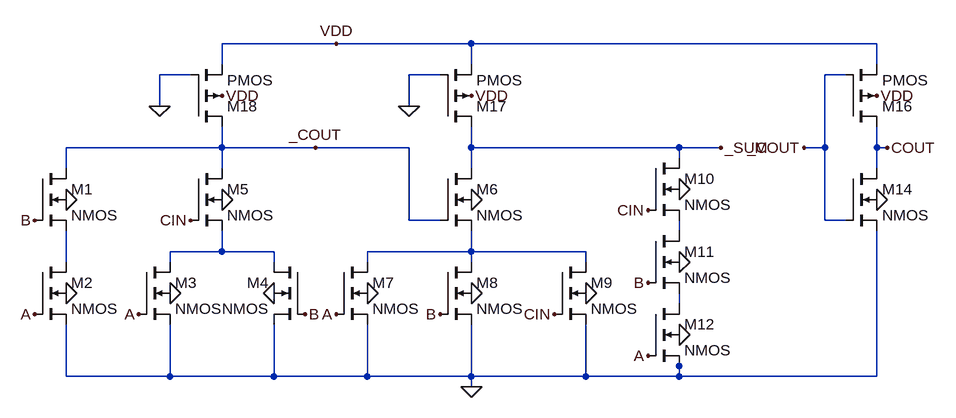
[diagram p0: schematic FA_psv1.asc]
FA_psv1.asc, the LTspice schematic file:
Version 4
SHEET 1 1232 680
WIRE 48 0 -128 0
WIRE 256 0 48 0
WIRE 880 0 256 0
WIRE -128 32 -128 0
WIRE 256 32 256 0
WIRE 880 32 880 0
WIRE -176 48 -224 48
WIRE 208 48 160 48
WIRE 832 48 800 48
WIRE -224 96 -224 48
WIRE 160 96 160 48
WIRE -128 160 -128 128
WIRE -128 160 -368 160
WIRE 16 160 -128 160
WIRE 160 160 16 160
WIRE 256 160 256 128
WIRE 576 160 256 160
WIRE 640 160 576 160
WIRE 800 160 800 48
WIRE 800 160 768 160
WIRE 880 160 880 128
WIRE 896 160 880 160
WIRE 576 176 576 160
WIRE -368 192 -368 160
WIRE -128 192 -128 160
WIRE 256 192 256 160
WIRE 880 192 880 160
WIRE 160 272 160 160
WIRE 208 272 160 272
WIRE 800 272 800 160
WIRE 832 272 800 272
WIRE 576 288 576 272
WIRE -128 320 -128 288
WIRE -128 320 -208 320
WIRE -48 320 -128 320
WIRE 256 320 256 288
WIRE 256 320 96 320
WIRE 432 320 256 320
WIRE -368 336 -368 288
WIRE -208 336 -208 320
WIRE -48 336 -48 320
WIRE 96 336 96 320
WIRE 256 336 256 320
WIRE 432 336 432 320
WIRE 576 400 576 384
WIRE 576 496 576 480
WIRE -368 512 -368 432
WIRE -208 512 -208 432
WIRE -208 512 -368 512
WIRE -48 512 -48 432
WIRE -48 512 -208 512
WIRE 96 512 96 432
WIRE 96 512 -48 512
WIRE 256 512 256 432
WIRE 256 512 96 512
WIRE 432 512 432 432
WIRE 432 512 256 512
WIRE 576 512 576 496
WIRE 576 512 432 512
WIRE 880 512 880 288
WIRE 880 512 576 512
WIRE 256 528 256 512
FLAG -416 416 A
FLAG -256 416 A
FLAG 48 416 A
FLAG 528 480 A
FLAG -416 272 B
FLAG 0 416 B
FLAG 208 416 B
FLAG 528 368 B
FLAG -176 272 CIN
FLAG 384 416 CIN
FLAG 528 256 CIN
FLAG -368 384 0
FLAG -368 240 0
FLAG -128 240 0
FLAG -208 384 0
FLAG -48 384 0
FLAG 96 384 0
FLAG 256 240 0
FLAG 432 384 0
FLAG 256 384 0
FLAG 576 448 0
FLAG 576 336 0
FLAG 576 224 0
FLAG 880 240 0
FLAG 880 80 VDD
FLAG 768 160 _COUT
FLAG 896 160 COUT
FLAG 16 160 _COUT
FLAG 256 528 0
FLAG 160 96 0
FLAG -224 96 0
FLAG 48 0 VDD
FLAG -128 80 VDD
FLAG 256 80 VDD
FLAG 640 160 _SUM
SYMBOL nmos4 -416 192 R0
SYMATTR InstName M1
SYMBOL nmos4 -416 336 R0
SYMATTR InstName M2
SYMBOL nmos4 -256 336 R0
SYMATTR InstName M3
SYMBOL nmos4 0 336 M0
SYMATTR InstName M4
SYMBOL nmos4 -176 192 R0
SYMATTR InstName M5
SYMBOL nmos4 208 192 R0
SYMATTR InstName M6
SYMBOL nmos4 48 336 R0
SYMATTR InstName M7
SYMBOL nmos4 208 336 R0
SYMATTR InstName M8
SYMBOL nmos4 384 336 R0
SYMATTR InstName M9
SYMBOL nmos4 528 176 R0
SYMATTR InstName M10
SYMBOL nmos4 528 288 R0
SYMATTR InstName M11
SYMBOL nmos4 528 400 R0
SYMATTR InstName M12
SYMBOL nmos4 832 192 R0
SYMATTR InstName M14
SYMBOL pmos4 832 128 M180
SYMATTR InstName M16
SYMBOL pmos4 208 128 M180
SYMATTR InstName M17
SYMBOL pmos4 -176 128 M180
SYMATTR InstName M18

The netlist it stands for:
* FA_psv1.asc
M1 _COUT B N004 0 NMOS
M2 N004 A 0 0 NMOS
M3 N002 A 0 0 NMOS
M4 N002 B 0 0 NMOS
M5 _COUT CIN N002 0 NMOS
M6 _SUM _COUT N003 0 NMOS
M7 N003 A 0 0 NMOS
M8 N003 B 0 0 NMOS
M9 N003 CIN 0 0 NMOS
M10 _SUM CIN N001 0 NMOS
M11 N001 B N005 0 NMOS
M12 N005 A 0 0 NMOS
M14 COUT _COUT 0 0 NMOS
M16 COUT _COUT VDD VDD PMOS
M17 _SUM 0 VDD VDD PMOS
M18 _COUT 0 VDD VDD PMOS
.model NMOS NMOS
.model PMOS PMOS
.lib standard.mos
.backanno
.end